# Altium project MIXR Power.PrjPcb (part 2 of 2)

## Sheet MIXR Power - Regulators.SchDoc: Title
size B; Organization: Midnight Sun Solar Rayce Car Team; Address1: University of Waterloo; Address2: 200 University Ave W; Address3: Waterloo, ON, Canada; Address4: N2L 3E9; Website: www.uwmidsun.com; ProjectName: ProjectName
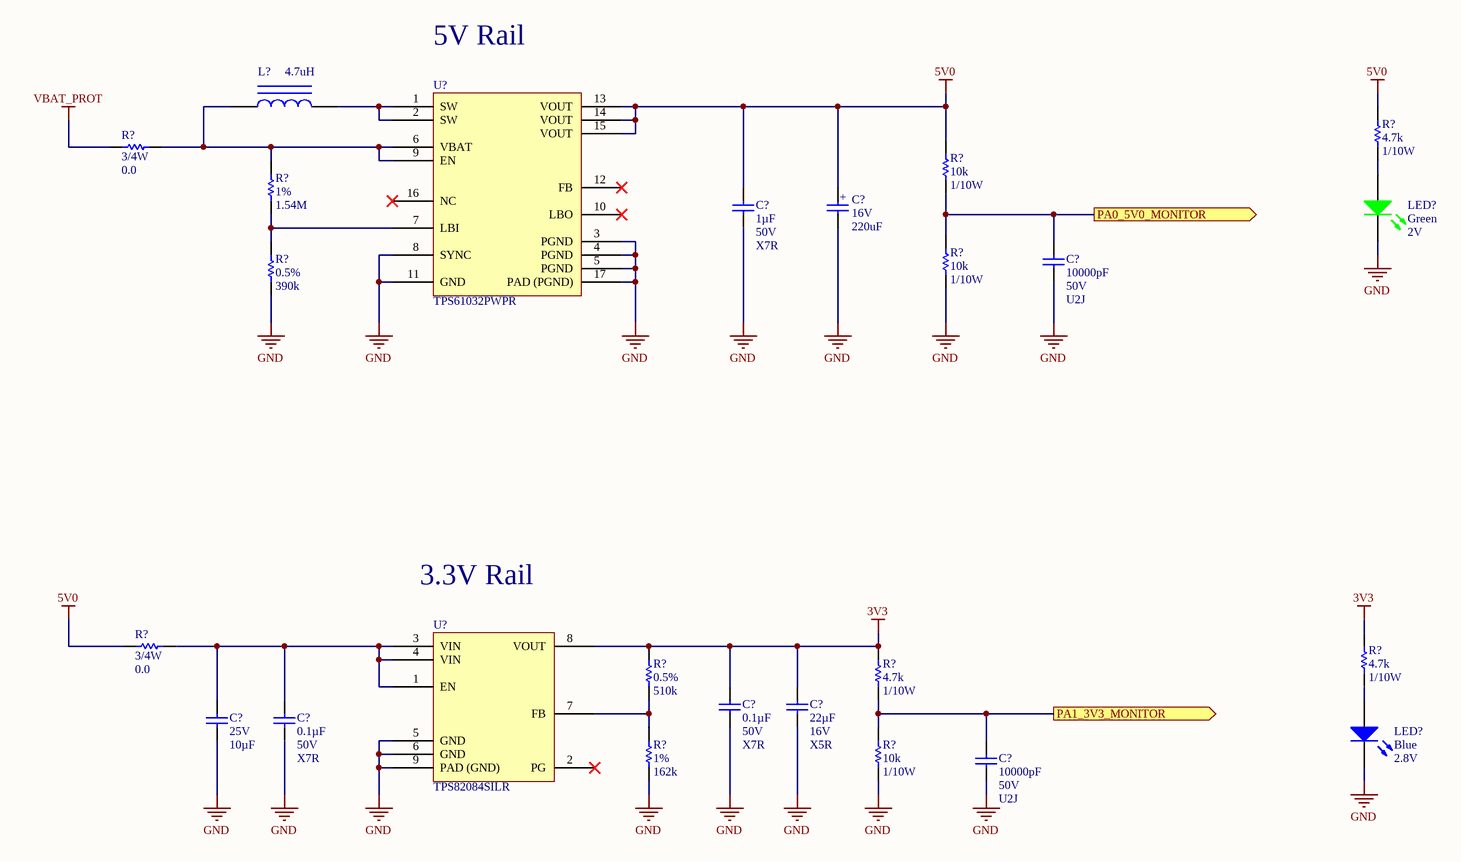
[diagram p3: MIXR Power - Regulators.SchDoc]

### Parts
(Parts that share a designator on the sheet are numbered #1, #2 ... from top to bottom, then left to right.)
C?#7  Capacitance: 1µF  Voltage: 50V  Temperature Coefficient: X7R  [CAP, 0603]  (hidden comment: CAP CER 1UF 50V 10% X7R 0603)
C?#8  Voltage: 16V  Capacitance: 220uF  [CAP ALUM 6.3MM RADIAL SMD]  (hidden comment: CAP ALUM 220UF 20% 16V SMD)
C?#9  Capacitance: 10000pF  Voltage: 50V  Temperature Coefficient: U2J  [CAP, 0603]  (hidden comment: CAP CER 10nF 50V 5% X7R 0603)
C?#10  Capacitance: 0.1µF  Voltage: 50V  Temperature Coefficient: X7R  [CAP, 0603]  (hidden comment: CAP CER 0.1UF 50V 10% X7R 0603)
C?#11  Capacitance: 22µF  Voltage: 16V  Temperature Coefficient: X5R  [CAP, 1210]  (hidden comment: CAP CER 22UF 16V ±20% X5R 1210)
C?#12  Voltage - Rated: 25V  Capacitance: 10µF  [CAP, 0805]  (hidden comment: CAP CER 10uF 25V 10% X5R 0805)
C?#13  Capacitance: 0.1µF  Voltage: 50V  Temperature Coefficient: X7R  [CAP, 0603]  (hidden comment: CAP CER 0.1UF 50V 10% X7R 0603)
C?#14  Capacitance: 10000pF  Voltage: 50V  Temperature Coefficient: U2J  [CAP, 0603]  (hidden comment: CAP CER 10nF 50V 5% X7R 0603)
L?  Inductance: 4.7uH  [IND 4.7uH 9.4A 10% SMD]  (hidden comment: IND 4.7uH 9.4A 10% SMD)
LED?#2  Color: Green  Voltage - Forward (Vf) (Typ): 2V  [LED_0603]  (hidden comment: LED GREEN CLEAR 2V 0603)
LED?#3  Color: Blue  Voltage - Forward (Vf) (Typ): 2.8V  [LED_0603]  (hidden comment: LED BLUE CLEAR 2.8V 0603)
R?#11  Resistance (Ohms): 4.7k  Power (Watts): 1/10W  [RES, 0603]  (hidden comment: RES 4.7K OHM 1% 1/10W 0603)
R?#12  Resistance: 10k  Power: 1/10W  [RES, 0603]  (hidden comment: RES 10K OHM 1% 1/10W 0603)
R?#13  Power (Watts): 3/4W  Resistance: 0.0  [RES 1206]  (hidden comment: RES 0.0 OHM 3/4W 1206)
R?#14  Tolerance: 1%  Resistance: 1.54M  [RES, 0603]  (hidden comment: RES 1.54M OHM 1% 1/10W 0603)
R?#15  Resistance: 10k  Power: 1/10W  [RES, 0603]  (hidden comment: RES 10K OHM 1% 1/10W 0603)
R?#16  Tolerance: 0.5%  Resistance: 390k  [RES, 0603]  (hidden comment: RES 390K OHM 1% 1/10W 0603)
R?#17  Resistance (Ohms): 4.7k  Power (Watts): 1/10W  [RES, 0603]  (hidden comment: RES 4.7K OHM 1% 1/10W 0603)
R?#18  Power (Watts): 3/4W  Resistance: 0.0  [RES 1206]  (hidden comment: RES 0.0 OHM 3/4W 1206)
R?#19  Tolerance: 0.5%  Resistance: 510k  [RES, 0603]  (hidden comment: RES 510K OHM 0.5% 1/10W 0603)
R?#20  Resistance (Ohms): 4.7k  Power (Watts): 1/10W  [RES, 0603]  (hidden comment: RES 4.7K OHM 1% 1/10W 0603)
R?#21  Tolerance: 1%  Resistance: 162k  [RES, 0603]  (hidden comment: RES 162K OHM 1% 1/10W 0603)
R?#22  Resistance: 10k  Power: 1/10W  [RES, 0603]  (hidden comment: RES 10K OHM 1% 1/10W 0603)
U?#3  Manufacturer Part Number: TPS61032PWPR  [IC REG BOOST 5V 3.6A 16-TSSOP]  (hidden comment: IC REG BOOST 5V 3.6A 16-TSSOP)
U?#4  Manufacturer Part Number: TPS82084SILR  [IC DCDC 0.8-6V 2A 8-uSIP]  (hidden comment: IC DCDC 0.8-6V 2A 8-uSIP)

### Ports
PA0_5V0_MONITOR (out), PA1_3V3_MONITOR (out)

### Nets
3V3: C?#10.1 C?#11.1 R?#17.1 R?#19.1 R?#20.1 U?#4.8(VOUT)
5V0: C?#7.1 C?#8.1 R?#11.1 R?#12.1 R?#18.1 U?#3.13(VOUT) U?#3.14(VOUT) U?#3.15(VOUT)
GND: C?#7.2 C?#8.2 C?#9.2 C?#10.2 C?#11.2 C?#12.2 C?#13.2 C?#14.2 LED?#2.2(K) LED?#3.2(K) R?#15.2 R?#16.2 R?#21.2 R?#22.2 U?#3.3(PGND) U?#3.4(PGND) U?#3.5(PGND) U?#3.8(SYNC) U?#3.11(GND) U?#3.17(PAD_(PGND)) U?#4.5(GND) U?#4.6(GND) U?#4.9(PAD_(GND))
VBAT_PROT: R?#13.1
PA0_5V0_MONITOR: C?#9.1 R?#12.2 R?#15.1 ; port PA0_5V0_MONITOR
PA1_3V3_MONITOR: C?#14.1 R?#20.2 R?#22.1 ; port PA1_3V3_MONITOR
NetC?#12_1: C?#12.1 C?#13.1 R?#18.2 U?#4.1(EN) U?#4.3(VIN) U?#4.4(VIN)
NetL?_1: L?.1 R?#13.2 R?#14.1 U?#3.6(VBAT) U?#3.9(EN)
NetL?_2: L?.2 U?#3.1(SW) U?#3.2(SW)
NetLED?#2_1: LED?#2.1(A) R?#11.2
NetLED?#3_1: LED?#3.1(A) R?#17.2
NetR?#14_2: R?#14.2 R?#16.1 U?#3.7(LBI)
NetR?#19_2: R?#19.2 R?#21.1 U?#4.7(FB)

Not connected (* = marked no-connect by the designer): U?#3 10(LBO)* 12(FB)* 16(NC)*; U?#4 2(PG)*

### Notes on the sheet
- 5V Rail
- 3.3V Rail
- PROJECT
- DOCUMENT
- DRAWN BY
- LAST MODIFIED
- PART NUMBER
- REVISION
- SHEET
- VARIANT
- OF
- (in symbol CAP ALUM 220UF 20% 16V SMD) +

### Library data of the parts
C?#7 = CAP CER 1UF 50V 10% X7R 0603: 1µF ±10% 50V Ceramic Capacitor X7R 0603 (1608 Metric); Manufacturer 1: Taiyo Yuden; Manufacturer Part Number 1: UMK107AB7105KA-T; Supplier 1: Digi-Key; Supplier Part Number 1: 587-3247-1-ND; Packaging: Cut Tape (CT); Part Status: Active; Operating Temperature: -55°C ~ 125°C; Ratings: -; Mounting Type: Surface Mount, MLCC; Package / Case: 0603 (1608 Metric); Size / Dimension: 0.063" L x 0.031" W (1.60mm x 0.80mm); Height - Seated (Max): -; Thickness (Max): 0.037" (0.95mm); Lead Spacing: -; Lead Style: -; ComponentLink1URL: http://www.yuden.co.jp/productdata/catalog/en/mlcc_all_e.pdf; ComponentLink1Description: http://www.yuden.co.jp/productdata/catalog/en/mlcc_all_e.pdf; Tolerance: ±10%
C?#8 = CAP ALUM 220UF 20% 16V SMD: 220µF 16V Aluminum Electrolytic Capacitors Radial, Can - SMD 2000 Hrs @ 85°C /; Manufacturer: Panasonic; Manufacturer Part Number: EEE-1CA221XAP; Ripple Current: 162mA; Polarity: Polar; Leakage Current: 3uA; Life (Hours): 2000Hour; Dissipation Factor: 0.2%; Supplier 1: Digi-Key; Supplier Part Number 1: PCE4583CT-ND; Stock 1: 3321; Pricing 1: 1 = 0.46000, 10 = 0.32200, 100 = 0.21190 (USD); RoHS: Yes; Mount: Surface Mount; Case/Package: Radial; Number of Pins: 8; Contact Plating: Tin; Min Operating Temperature: -40°C; Max Operating Temperature: 85°C; Tolerance: 20%; Voltage Rating (DC): 16V; Voltage Rating: 16V; Packaging: Tape and Reel; Package Quantity: 900; Ripple Current (AC): 162mA; Termination: SMD/SMT; Diameter: 6.3mm; Length: 8mm; Height: 7.7mm; Height - Seated (Max): 0.303inch; Radiation Hardening: No; REACH SVHC: No SVHC; ComponentLink1URL: https://datasheet.ciiva.com/30258/aba0000ce115-30258470.pdf?src-supplier=Onlinecomponents.com; ComponentLink1Description: https://datasheet.ciiva.com/30258/aba0000ce115-30258470.pdf?src-supplier=Onlinecomponents.com; ComponentLink2URL: https://datasheet.ciiva.com/46378/1790637-46378313.pdf?src-supplier=Element14; ComponentLink2Description: https://datasheet.ciiva.com/46378/1790637-46378313.pdf?src-supplier=Element14; ComponentLink3URL: https://datasheet.ciiva.com/2985/aba0000ce115-2985082.pdf?src-supplier=Avnet; ComponentLink3Description: https://datasheet.ciiva.com/2985/aba0000ce115-2985082.pdf?src-supplier=Avnet; ComponentLink4URL: https://datasheet.ciiva.com/2985/aba0000ce115-2985083.pdf?src-supplier=Avnet; ComponentLink4Description: https://datasheet.ciiva.com/2985/aba0000ce115-2985083.pdf?src-supplier=Avnet; ComponentLink5URL: https://datasheet.ciiva.com/43470/1790637-43470636.pdf?src-supplier=Farnell; ComponentLink5Description: https://datasheet.ciiva.com/43470/1790637-43470636.pdf?src-supplier=Farnell; ComponentLink6URL: https://datasheet.ciiva.com/17530/aba0000ce115-17530127.pdf?src-supplier=Avnet+Europe; ComponentLink6Description: https://datasheet.ciiva.com/17530/aba0000ce115-17530127.pdf?src-supplier=Avnet+Europe; ComponentLink7URL: https://datasheet.ciiva.com/46374/1790637-46374335.pdf?src-supplier=Element14; ComponentLink7Description: https://datasheet.ciiva.com/46374/1790637-46374335.pdf?src-supplier=Element14
C?#9 C?#14 = CAP CER 10nF 50V 5% X7R 0603: 10000pF ±5% 50V Ceramic Capacitor U2J 0603 (1608 Metric); Manufacturer 1: KEMET; Manufacturer Part Number 1: C0603C103J5JAC7867; Supplier 1: Digi-Key; Supplier Part Number 1: 399-13384-1-ND; Packaging: Cut Tape (CT); Part Status: Active; Operating Temperature: -55°C ~ 125°C; Ratings: -; Failure Rate: -; Mounting Type: Surface Mount, MLCC; Package / Case: 0603 (1608 Metric); Size / Dimension: 0.063" L x 0.032" W (1.60mm x 0.80mm); Height - Seated (Max): -; Thickness (Max): 0.034" (0.87mm); Lead Spacing: -; Lead Style: -; ComponentLink1URL: http://www.kemet.com/docfinder?Partnumber=C0603C103J5JAC7867; ComponentLink1Description: http://www.kemet.com/docfinder?Partnumber=C0603C103J5JAC7867; Tolerance: ±5%
C?#10 C?#13 = CAP CER 0.1UF 50V 10% X7R 0603: 0.10µF ±10% 50V Ceramic Capacitor X7R 0603 (1608 Metric); Manufacturer 1: AVX Corporation; Manufacturer Part Number 1: 06035C104KAT2A; Supplier 1: Digi-Key; Supplier Part Number 1: 478-5052-1-ND; Packaging: Cut Tape (CT); Part Status: Active; Operating Temperature: -55°C ~ 125°C; Ratings: -; Mounting Type: Surface Mount, MLCC; Package / Case: 0603 (1608 Metric); Size / Dimension: 0.063" L x 0.032" W (1.60mm x 0.81mm); Height - Seated (Max): -; Thickness (Max): 0.035" (0.90mm); Lead Spacing: -; Lead Style: -; ComponentLink1URL: http://datasheets.avx.com/X7RDielectric.pdf; ComponentLink1Description: http://datasheets.avx.com/X7RDielectric.pdf; Tolerance: ±10%
C?#11 = CAP CER 22UF 16V ±20% X5R 1210: 22µF ±20% 16V Ceramic Capacitor X5R 1210 (3225 Metric); Manufacturer 1: Murata Electronics North America; Manufacturer Part Number 1: GRM32ER61C226ME20L; Supplier 1: Digi-Key; Supplier Part Number 1: 490-1881-1-ND; Packaging: Cut Tape (CT); Part Status: Active; Operating Temperature: -55°C ~ 85°C; Ratings: -; Mounting Type: Surface Mount, MLCC; Package / Case: 1210 (3225 Metric); Size / Dimension: 0.126" L x 0.098" W (3.20mm x 2.50mm); Height - Seated (Max): -; Thickness (Max): 0.106" (2.70mm); Lead Spacing: -; Lead Style: -; ComponentLink1URL: http://www.murata.com/~/media/webrenewal/support/library/catalog/products/capacitor/mlcc/c02e.ashx; ComponentLink1Description: http://www.murata.com/~/media/webrenewal/support/library/catalog/products/capacitor/mlcc/c02e.ashx; Tolerance: ±20%
C?#12 = CAP CER 10uF 25V 10% X5R 0805: 10µF ±10% 25V Ceramic Capacitor X5R 0805 (2012 Metric); Manufacturer: Murata Electronics North America; Manufacturer Part Number: GRM21BR61E106KA73L; Supplier 1: Digi-Key; RoHS: RoHS Compliant; Category: Capacitors; Stock 1: 1695157; Packaging: Cut Tape (CT); Part Status: Active; Tolerance: ±10%; Temperature Coefficient: X5R; Operating Temperature: -55°C ~ 85°C; Features: -; Ratings: -; Applications: General Purpose; Mounting Type: Surface Mount, MLCC; Package / Case: 0805 (2012 Metric); Size / Dimension: 0.079" L x 0.049" W (2.00mm x 1.25mm); Height - Seated (Max): -; Thickness (Max): 0.053" (1.35mm); Lead Spacing: -; Lead Style: -; ComponentLink1URL: http://search.murata.co.jp/Ceramy/image/img/A01X/G101/ENG/GRM21BR61E106KA73-01.pdf; ComponentLink1Description: http://search.murata.co.jp/Ceramy/image/img/A01X/G101/ENG/GRM21BR61E106KA73-01.pdf; Supplier Part Number 1: 490-5523-1-ND; Pricing 1: 1=0.3, 10=0.214, 100=0.1008, 500=0.07068, 1000=0.05851 (CAD)
L? = IND 4.7uH 9.4A 10% SMD: Fixed Inductors SER1360 High Current 4.7 uH 10 % 9.4 A; Manufacturer: Coilcraft; Manufacturer Part Number: SER1360-472KLB; Core Material: Ferrite; Self Resonant Frequency: 32MHz; Shielding: Shielded; DC Resistance (DCR): 6.05mR; Test Frequency: 100kHz; Supplier 1: Mouser; Supplier Part Number 1: 994-SER1360-472KLB; Stock 1: 2176; Pricing 1: 1 = 2.07000, 10 = 1.85000, 50 = 1.66000, 100 = 1.48000, 1000 = 1.07000, 10000 = 0.99800 (USD); RoHS: Yes; Min Operating Temperature: -40°C; Max Operating Temperature: 85°C; Packaging: Cut Tape; Tolerance: 10%; Termination: SMD/SMT; Length: 13mm; Height: 5.8mm; Width: 12.9mm; Lead Free: Contains Lead; ComponentLink1URL: http://www.mouser.com/ds/2/597/ser1360-270713.pdf?src-supplier=Mouser; ComponentLink1Description: http://www.mouser.com/ds/2/597/ser1360-270713.pdf?src-supplier=Mouser; Max DC Current: 9.4A
LED?#2 = LED GREEN CLEAR 2V 0603: Green 572nm LED Indication - Discrete 2V 0603 (1608 Metric); Manufacturer: Wurth Electronics Inc.; Manufacturer Part Number: 150060VS75000; Lens Color: Colorless; Millicandela Rating: 40mcd; Lens Style/Size: Rectangle with Flat Top, 1.10mm x 0.70mm; Current - Test: 20mA; Viewing Angle: 140°; Wavelength - Dominant: 570nm; Supplier 1: Digi-Key; RoHS: RoHS Compliant; Category: Optoelectronics; Stock 1: 9408; Pricing 1: 1=0.21, 100=0.1617, 500=0.13964 (CAD); Packaging: Cut Tape (CT); Part Status: Active; Lens Transparency: Clear; Mounting Type: Surface Mount; Wavelength - Peak: 572nm; Features: -; Package / Case: 0603 (1608 Metric); Supplier Device Package: 0603; Size / Dimension: 1.60mm L x 0.80mm W; Height (Max): 0.80mm; ComponentLink1URL: http://katalog.we-online.de/led/datasheet/150060VS75000.pdf; ComponentLink1Description: http://katalog.we-online.de/led/datasheet/150060VS75000.pdf; Supplier Part Number 1: 732-4980-1-ND
LED?#3 = LED BLUE CLEAR 2.8V 0603: Blue 470nm LED Indication - Discrete 2.8V 0603 (1608 Metric); Manufacturer 1: Lite-On Inc.; Manufacturer Part Number 1: LTST-C193TBKT-5A; Lens Color: Colorless; Millicandela Rating: 15mcd; Lens Style/Size: Rectangle with Flat Top, 1.15mm x 0.80mm; Current - Test: 5mA; Viewing Angle: 130°; Wavelength - Peak: 468nm; Supplier 1: Digi-Key; Supplier Part Number 1: 160-1827-1-ND; Packaging: Cut Tape (CT); Part Status: Active; Lens Transparency: Clear; Mounting Type: Surface Mount; Wavelength - Dominant: 470nm; Package / Case: 0603 (1608 Metric); Supplier Device Package: Chip LED; Size / Dimension: 1.60mm L x 0.80mm W; Height (Max): 0.45mm; ComponentLink1URL: http://optoelectronics.liteon.com/upload/download/DS22-2004-060/P_100_LTST-C193TBKT-5A.pdf; ComponentLink1Description: http://optoelectronics.liteon.com/upload/download/DS22-2004-060/P_100_LTST-C193TBKT-5A.pdf
R?#11 R?#17 R?#20 = RES 4.7K OHM 1% 1/10W 0603: 4.7k Ohm ±1% 0.1W, 1/10W Chip Resistor 0603 (1608 Metric) Moisture Resistant Thick Film; Manufacturer 1: Yageo; Manufacturer Part Number 1: RC0603FR-074K7L; Description 1: RES SMD 4.7K OHM 1% 1/10W 0603; Temperature Coefficient: ±100ppm/°C; Supplier 1: Digi-Key; Supplier Part Number 1: 311-4.70KHRCT-ND; RoHS: RoHS Compliant; Category: Resistors; Stock 1: 3487566; Pricing 1: 1=0.16, 10=0.022, 100=0.0089, 1000=0.00402, 2500=0.00349 (CAD); Packaging: Cut Tape (CT); Part Status: Active; Composition: Thick Film; Features: Moisture Resistant; Operating Temperature: -55°C ~ 155°C; Package / Case: 0603 (1608 Metric); Supplier Device Package: 0603; Size / Dimension: 0.063" L x 0.031" W (1.60mm x 0.80mm); Height - Seated (Max): 0.022" (0.55mm); Failure Rate: -; ComponentLink1URL: http://www.yageo.com/documents/recent/PYu-RC_Group_51_RoHS_L_7.pdf; ComponentLink1Description: http://www.yageo.com/documents/recent/PYu-RC_Group_51_RoHS_L_7.pdf; Tolerance: ±1%
R?#12 R?#15 R?#22 = RES 10K OHM 1% 1/10W 0603: RES SMD 10K OHM 1% 1/10W 0603; Manufacturer 1: Yageo; Manufacturer Part Number 1: RC0603FR-0710KL; Temperature Coefficient: ±100ppm/°C; Supplier 1: Digi-Key; Supplier Part Number 1: 311-10.0KHRCT-ND; Packaging: Cut Tape (CT); Part Status: Active; Composition: Thick Film; Operating Temperature: -55°C ~ 155°C; Package / Case: 0603 (1608 Metric); Supplier Device Package: 0603; Size / Dimension: 0.063" L x 0.031" W (1.60mm x 0.80mm); Height - Seated (Max): 0.022" (0.55mm); Failure Rate: -; ComponentLink1URL: http://www.yageo.com/documents/recent/PYu-RC_Group_51_RoHS_L_7.pdf; ComponentLink1Description: http://www.yageo.com/documents/recent/PYu-RC_Group_51_RoHS_L_7.pdf; Tolerance: ±1%
R?#13 R?#18 = RES 0.0 OHM 3/4W 1206: 0 Ohms Jumper 0.75W, 3/4W Chip Resistor 1206 (3216 Metric) Automotive AEC-Q200 Metal Foil; Manufacturer: Stackpole Electronics Inc.; Manufacturer Part Number: HCJ1206ZT0R00; Supplier 1: Digi-Key; RoHS: RoHS Compliant; Category: Resistors; Stock 1: 1029426; Pricing 1: 1=0.82, 10=0.583, 25=0.4552, 50=0.3852, 100=0.3034, 250=0.25676, 500=0.21006, 1000=0.16337 (CAD); Packaging: Cut Tape (CT); Part Status: Active; Tolerance: Jumper; Composition: Metal Foil; Features: Automotive AEC-Q200; Temperature Coefficient: -; Operating Temperature: -55°C ~ 155°C; Package / Case: 1206 (3216 Metric); Supplier Device Package: 1206; Size / Dimension: 0.122" L x 0.061" W (3.10mm x 1.55mm); Height - Seated (Max): 0.032" (0.80mm); Failure Rate: -; ComponentLink1URL: https://www.seielect.com/catalog/SEI-HCJ.pdf; ComponentLink1Description: https://www.seielect.com/catalog/SEI-HCJ.pdf; Supplier Part Number 1: HCJ1206ZT0R00CT-ND
R?#14 = RES 1.54M OHM 1% 1/10W 0603: Manufacturer: Vishay; Manufacturer Part Number: CRCW06031M54FKEA; Power Rating: 100mW; Voltage Rating: 75V; Temperature Coefficient: 100ppm/°C; Supplier 1: Digi-Key; Supplier Part Number 1: 541-1.54MHCT-ND; Stock 1: 7311; Pricing 1: 1 = 0.10000, 10 = 0.04000, 100 = 0.01620, 1000 = 0.00729, 2500 = 0.00633 (USD); RoHS: Yes; Case/Package: 0603; Number of Pins: 2; Weight: 7.1E-05oz; Case Code (Imperial): 0603; Case Code (Metric): 1608; Contact Plating: Tin; Min Operating Temperature: -55°C; Max Operating Temperature: 155°C; Packaging: Tape and Reel; Package Quantity: 10; Termination: SMD/SMT; Composition: Thick Film; Number of Terminations: 2; Military Standard: Not; Max Power Dissipation: 100mW; Features: Automotive AEC-Q200; Length: 1.55mm; Height: 0.02inch; Width: 0.85mm; Depth: 0.85mm; Radiation Hardening: No; REACH SVHC: Unknown; Lead Free: Lead Free; ComponentLink1URL: https://datasheet.ciiva.com/7670/1697337-7670550.pdf?src-supplier=Element14; ComponentLink1Description: https://datasheet.ciiva.com/7670/1697337-7670550.pdf?src-supplier=Element14; ComponentLink2URL: https://datasheet.ciiva.com/7670/1697337-7670551.pdf?src-supplier=Element14; ComponentLink2Description: https://datasheet.ciiva.com/7670/1697337-7670551.pdf?src-supplier=Element14; ComponentLink3URL: https://datasheet.ciiva.com/5585/dcrcwe3-109170-5585144.pdf?src-supplier=Mouser; ComponentLink3Description: https://datasheet.ciiva.com/5585/dcrcwe3-109170-5585144.pdf?src-supplier=Mouser; ComponentLink4URL: https://datasheet.ciiva.com/22676/1700796-22676058.pdf?src-supplier=Element14; ComponentLink4Description: https://datasheet.ciiva.com/22676/1700796-22676058.pdf?src-supplier=Element14; ComponentLink5URL: https://datasheet.ciiva.com/22676/1847332-22676059.pdf?src-supplier=Element14; ComponentLink5Description: https://datasheet.ciiva.com/22676/1847332-22676059.pdf?src-supplier=Element14; ComponentLink6URL: https://datasheet.ciiva.com/2513/dcrcwe3-2513692.pdf?src-supplier=Digi-Key; ComponentLink6Description: https://datasheet.ciiva.com/2513/dcrcwe3-2513692.pdf?src-supplier=Digi-Key; ComponentLink7URL: https://datasheet.ciiva.com/2513/dcrcwe3-2513693.pdf?src-supplier=Digi-Key; ComponentLink7Description: https://datasheet.ciiva.com/2513/dcrcwe3-2513693.pdf?src-supplier=Digi-Key; ComponentLink8URL: https://datasheet.ciiva.com/2513/dcrcwe3-2513694.pdf?src-supplier=Digi-Key; ComponentLink8Description: https://datasheet.ciiva.com/2513/dcrcwe3-2513694.pdf?src-supplier=Digi-Key; Voltage Rating (DC): 75V
R?#16 = RES 390K OHM 1% 1/10W 0603: 390 kOhms ±0.5% 0.1W, 1/10W Chip Resistor 0603 (1608 Metric) Thin Film /; Manufacturer: Yageo; Manufacturer Part Number: RT0603DRE07390KL; Max Power Dissipation: 100mW; Temperature Coefficient: 50ppm/°C; Supplier 1: Digi-Key; Supplier Part Number 1: 311-2555-1-ND; Stock 1: 4470; Pricing 1: 1 = 0.13000, 10 = 0.11900, 100 = 0.04580, 1000 = 0.02014, 2500 = 0.01740 (USD); RoHS: Yes; Case/Package: 0603; Case Code (Metric): 1608; Case Code (Imperial): 0603; Min Operating Temperature: -55°C; Max Operating Temperature: 155°C; Packaging: Tape and Reel; Composition: Thin Film; Number of Terminations: 2; Features: Moisture Resistant; Length: 0.063inch; Height: 0.022inch; Width: 0.031inch; ComponentLink1URL: http://www.yageo.com/documents/recent/PYu-RT_1-to-0.01_RoHS_L_9.pdf?src-supplier=Digi-Key; ComponentLink1Description: http://www.yageo.com/documents/recent/PYu-RT_1-to-0.01_RoHS_L_9.pdf?src-supplier=Digi-Key
R?#19 = RES 510K OHM 0.5% 1/10W 0603: 510 kOhms ±0.5% 0.1W, 1/10W Chip Resistor 0603 (1608 Metric) Thin Film /; Manufacturer: Yageo; Manufacturer Part Number: RT0603DRE07510KL; Max Power Dissipation: 100mW; Temperature Coefficient: 50ppm/°C; Supplier 1: Digi-Key; Supplier Part Number 1: 311-2610-1-ND; Stock 1: 5404; Pricing 1: 1 = 0.13000, 10 = 0.11900, 100 = 0.04580, 1000 = 0.02014, 2500 = 0.01740 (USD); RoHS: Yes; Case/Package: 0603; Case Code (Metric): 1608; Case Code (Imperial): 0603; Min Operating Temperature: -55°C; Max Operating Temperature: 155°C; Packaging: Tape and Reel; Composition: Thin Film; Number of Terminations: 2; Features: Moisture Resistant; Length: 0.063inch; Height: 0.022inch; Width: 0.031inch; ComponentLink1URL: http://www.yageo.com/documents/recent/PYu-RT_1-to-0.01_RoHS_L_9.pdf?src-supplier=Digi-Key; ComponentLink1Description: http://www.yageo.com/documents/recent/PYu-RT_1-to-0.01_RoHS_L_9.pdf?src-supplier=Digi-Key
R?#21 = RES 162K OHM 1% 1/10W 0603: 162 kOhms ±1% 0.1W, 1/10W Chip Resistor 0603 (1608 Metric) Moisture Resistant Thick Film /; Manufacturer: Yageo; Manufacturer Part Number: RC0603FR-07162KL; Power Rating: 100mW; Temperature Coefficient: 100ppm/°C; Voltage Rating (DC): 50V; Voltage Rating: 75V; Supplier 1: Digi-Key; Supplier Part Number 1: 311-162KHRCT-ND; Stock 1: 328469; Pricing 1: 1 = 0.10000, 10 = 0.02400, 100 = 0.00970, 1000 = 0.00437, 2500 = 0.00379 (USD); RoHS: Yes; Mount: Surface Mount; Case/Package: 0603; Weight: 7.1E-05oz; Case Code (Imperial): 0603; Case Code (Metric): 1608; Min Operating Temperature: -55°C; Max Operating Temperature: 155°C; Packaging: Tape and Reel; Composition: Thick Film; Military Standard: Not; Termination: SMD/SMT; Length: 1.6mm; Height: 0.45mm; Width: 0.8mm; Depth: 0.8mm; Lead Free: Lead Free; ComponentLink1URL: https://datasheet.ciiva.com/11819/0900766b80f96399-11819240.pdf?src-supplier=RSComponents; ComponentLink1Description: https://datasheet.ciiva.com/11819/0900766b80f96399-11819240.pdf?src-supplier=RSComponents
U?#3 = IC REG BOOST 5V 3.6A 16-TSSOP: Boost Switching Regulator IC Positive Fixed 5V 1 Output 3.6A (Switch) 16-PowerTSSOP (0.173", 4.40mm Width); Manufacturer: Texas Instruments; Output Current: 1A; Operating Supply Voltage: 5.5V; Min Input Voltage: 1.8V; Number of Outputs: 1; Efficiency: 96%; Switching Frequency: 600kHz; Synchronous Rectifier: Yes; Quiescent Current: 20uA; Current Rating: 20mA; Supplier 1: Digi-Key; Supplier Part Number 1: 296-14418-1-ND; Stock 1: 5321; Pricing 1: 1 = 2.76000, 10 = 2.48100, 100 = 2.03260, 500 = 1.73032, 1000 = 1.45930 (USD); RoHS: Yes; Mount: Surface Mount; Case/Package: HTSSOP EP; Number of Pins: 16; Weight: 0.002212oz; Min Operating Temperature: -40°C; Max Operating Temperature: 85°C; Output Voltage: 5V; Package Quantity: 1; Max Input Voltage: 5.5V; Packaging: Tape and Reel; Max Output Current: 1A; Nominal Output Voltage: 5V; Min Output Voltage: 5V; Topology: Boost; Output Type: Fixed; Output Configuration: Positive; Width: 4.4mm; Radiation Hardening: No; REACH SVHC: No SVHC; Lead Free: Lead Free; ComponentLink1URL: https://datasheet.ciiva.com/15113/getdatasheetpartid-188303-15113715.pdf?src-supplier=Verical; ComponentLink1Description: https://datasheet.ciiva.com/15113/getdatasheetpartid-188303-15113715.pdf?src-supplier=Verical; ComponentLink2URL: https://datasheet.ciiva.com/26896/tps61032pwpr-26896609.pdf?src-supplier=IIIC; ComponentLink2Description: https://datasheet.ciiva.com/26896/tps61032pwpr-26896609.pdf?src-supplier=IIIC; ComponentLink3URL: https://datasheet.ciiva.com/2026/tps61030-2026195.pdf?src-supplier=Digi-Key; ComponentLink3Description: https://datasheet.ciiva.com/2026/tps61030-2026195.pdf?src-supplier=Digi-Key; ComponentLink4URL: https://datasheet.ciiva.com/2026/tps61030-2026196.pdf?src-supplier=Digi-Key; ComponentLink4Description: https://datasheet.ciiva.com/2026/tps61030-2026196.pdf?src-supplier=Digi-Key; ComponentLink5URL: https://datasheet.ciiva.com/2026/tps61030-2026197.pdf?src-supplier=Digi-Key; ComponentLink5Description: https://datasheet.ciiva.com/2026/tps61030-2026197.pdf?src-supplier=Digi-Key; ComponentLink6URL: https://datasheet.ciiva.com/49118/1864381-49118279.pdf?src-supplier=Element14; ComponentLink6Description: https://datasheet.ciiva.com/49118/1864381-49118279.pdf?src-supplier=Element14
U?#4 = IC DCDC 0.8-6V 2A 8-uSIP: Non-Isolated PoL Module DC DC Converter 1 Output 0.8 ~ 6V 2A 2.5V - 6V Input; Manufacturer: Texas Instruments; Number of Outputs: 1; Min Output Voltage: 800mV; Switching Frequency: 2.4MHz; Synchronous Rectifier: Yes; Efficiency: 95%; Quiescent Current: 17uA; Output Type: Adjustable; Output Configuration: Positive; Supplier 1: Digi-Key; Supplier Part Number 1: 296-46279-1-ND; Stock 1: 31772; Pricing 1: 1 = 3.12000, 10 = 2.80400, 100 = 2.29770, 500 = 1.95602, 1000 = 1.64965 (USD); RoHS: Yes; Mount: Surface Mount; Case/Package: Module; Number of Pins: 8; Min Operating Temperature: -40°C; Max Operating Temperature: 125°C; Packaging: Tape and Reel; Min Input Voltage: 2.5V; Max Input Voltage: 6V; Max Output Voltage: 6V; Output Current: 2A; Output Voltage: 6V; Max Output Current: 2A; Operating Supply Voltage: 6V; Lead Free: Lead Free; ComponentLink1URL: http://www.ti.com/lit/ds/symlink/tps82084.pdf?src-supplier=Digi-Key; ComponentLink1Description: http://www.ti.com/lit/ds/symlink/tps82084.pdf?src-supplier=Digi-Key; ComponentLink2URL: http://www.ti.com/general/docs/lit/getliterature.tsp?genericPartNumber=TPS82084&&fileType=pdf&src-supplier=Avnet; ComponentLink2Description: http://www.ti.com/general/docs/lit/getliterature.tsp?genericPartNumber=TPS82084&&fileType=pdf&src-supplier=Avnet

## Nets that join several sheets
3V3: MIXR Power - Connectors (P3.1), MIXR Power - Battery Charging (R23.1 R25.1 R26.1), MIXR Power - Battery Management System (C?#2.1 FB?.2 R?#7.1 U?#2.5), MIXR Power - Regulators (6 pins)
5V0: MIXR Power - Connectors (5 pins), MIXR Power - Regulators (8 pins)
BAT_GND: MIXR Power - Connectors (P2.2), MIXR Power - Battery Management System (C?#1.2 Q?#1.2 U?#1.6)
GND: MIXR Power - Connectors (24 pins), MIXR Power - Battery Charging (12 pins), MIXR Power - Battery Management System (13 pins), MIXR Power - Regulators (23 pins)
V_USB: MIXR Power - Connectors (C1.1 D1.5 F1.2 VUSB.TP), MIXR Power - Battery Charging (C16.1 U5.1 U5.24)
VBAT: MIXR Power - Battery Charging (C20.1 U5.13 U5.14), MIXR Power - Battery Management System (5 pins)
VBAT_CELL: MIXR Power - Connectors (P2.1), MIXR Power - Battery Management System (F?.1)
VBAT_PROT: MIXR Power - Battery Charging (5 pins), MIXR Power - Regulators (R?#13.1)
NetD1_4: MIXR Power - Connectors (D1.4 D-.TP), MIXR Power - Battery Charging (U5.4)
NetD1_6: MIXR Power - Connectors (D1.6 D+.TP), MIXR Power - Battery Charging (U5.3)
PA0_5V0_MONITOR: MIXR Power - Connectors (P1.25), MIXR Power - Regulators (C?#9.1 R?#12.2 R?#15.1)
PA1_3V3_MONITOR: MIXR Power - Connectors (P1.24), MIXR Power - Regulators (C?#14.1 R?#20.2 R?#22.1)
PA2_BAT_VOLTAGE_MONITOR: MIXR Power - Connectors (P1.23), MIXR Power - Battery Management System (C?#6.1 R?#6.2 R?#8.1)
PA3_BAT_CURRENT_MONITOR: MIXR Power - Connectors (P1.22), MIXR Power - Battery Management System (C?#4.1 R?#5.2)
PA4_BAT_TEMP_MONITOR: MIXR Power - Connectors (P1.21 P2.3), MIXR Power - Battery Management System (C?#5.1 R?#7.2 RT?.2)
PA6_OTG_EN: MIXR Power - Connectors (P1.19 P8.1), MIXR Power - Battery Charging (R24.1 U5.6)
PA7_BAT_VOLTAGE_MONITOR_EN: MIXR Power - Connectors (P1.18), MIXR Power - Battery Management System (R?#9.1)
PA8_nCHARGE_EN: MIXR Power - Connectors (P1.17 P8.2), MIXR Power - Battery Charging (R23.2 U5.9)
PB10_POWER_GOOD: MIXR Power - Connectors (P1.14 P7.2), MIXR Power - Battery Charging (R25.2 U5.7)
PB11_CHARGER_STATUS: MIXR Power - Connectors (P1.13 P7.1), MIXR Power - Battery Charging (R26.2 U5.5)